# EAGLE design M7101 (EAGLE 6.6.0)
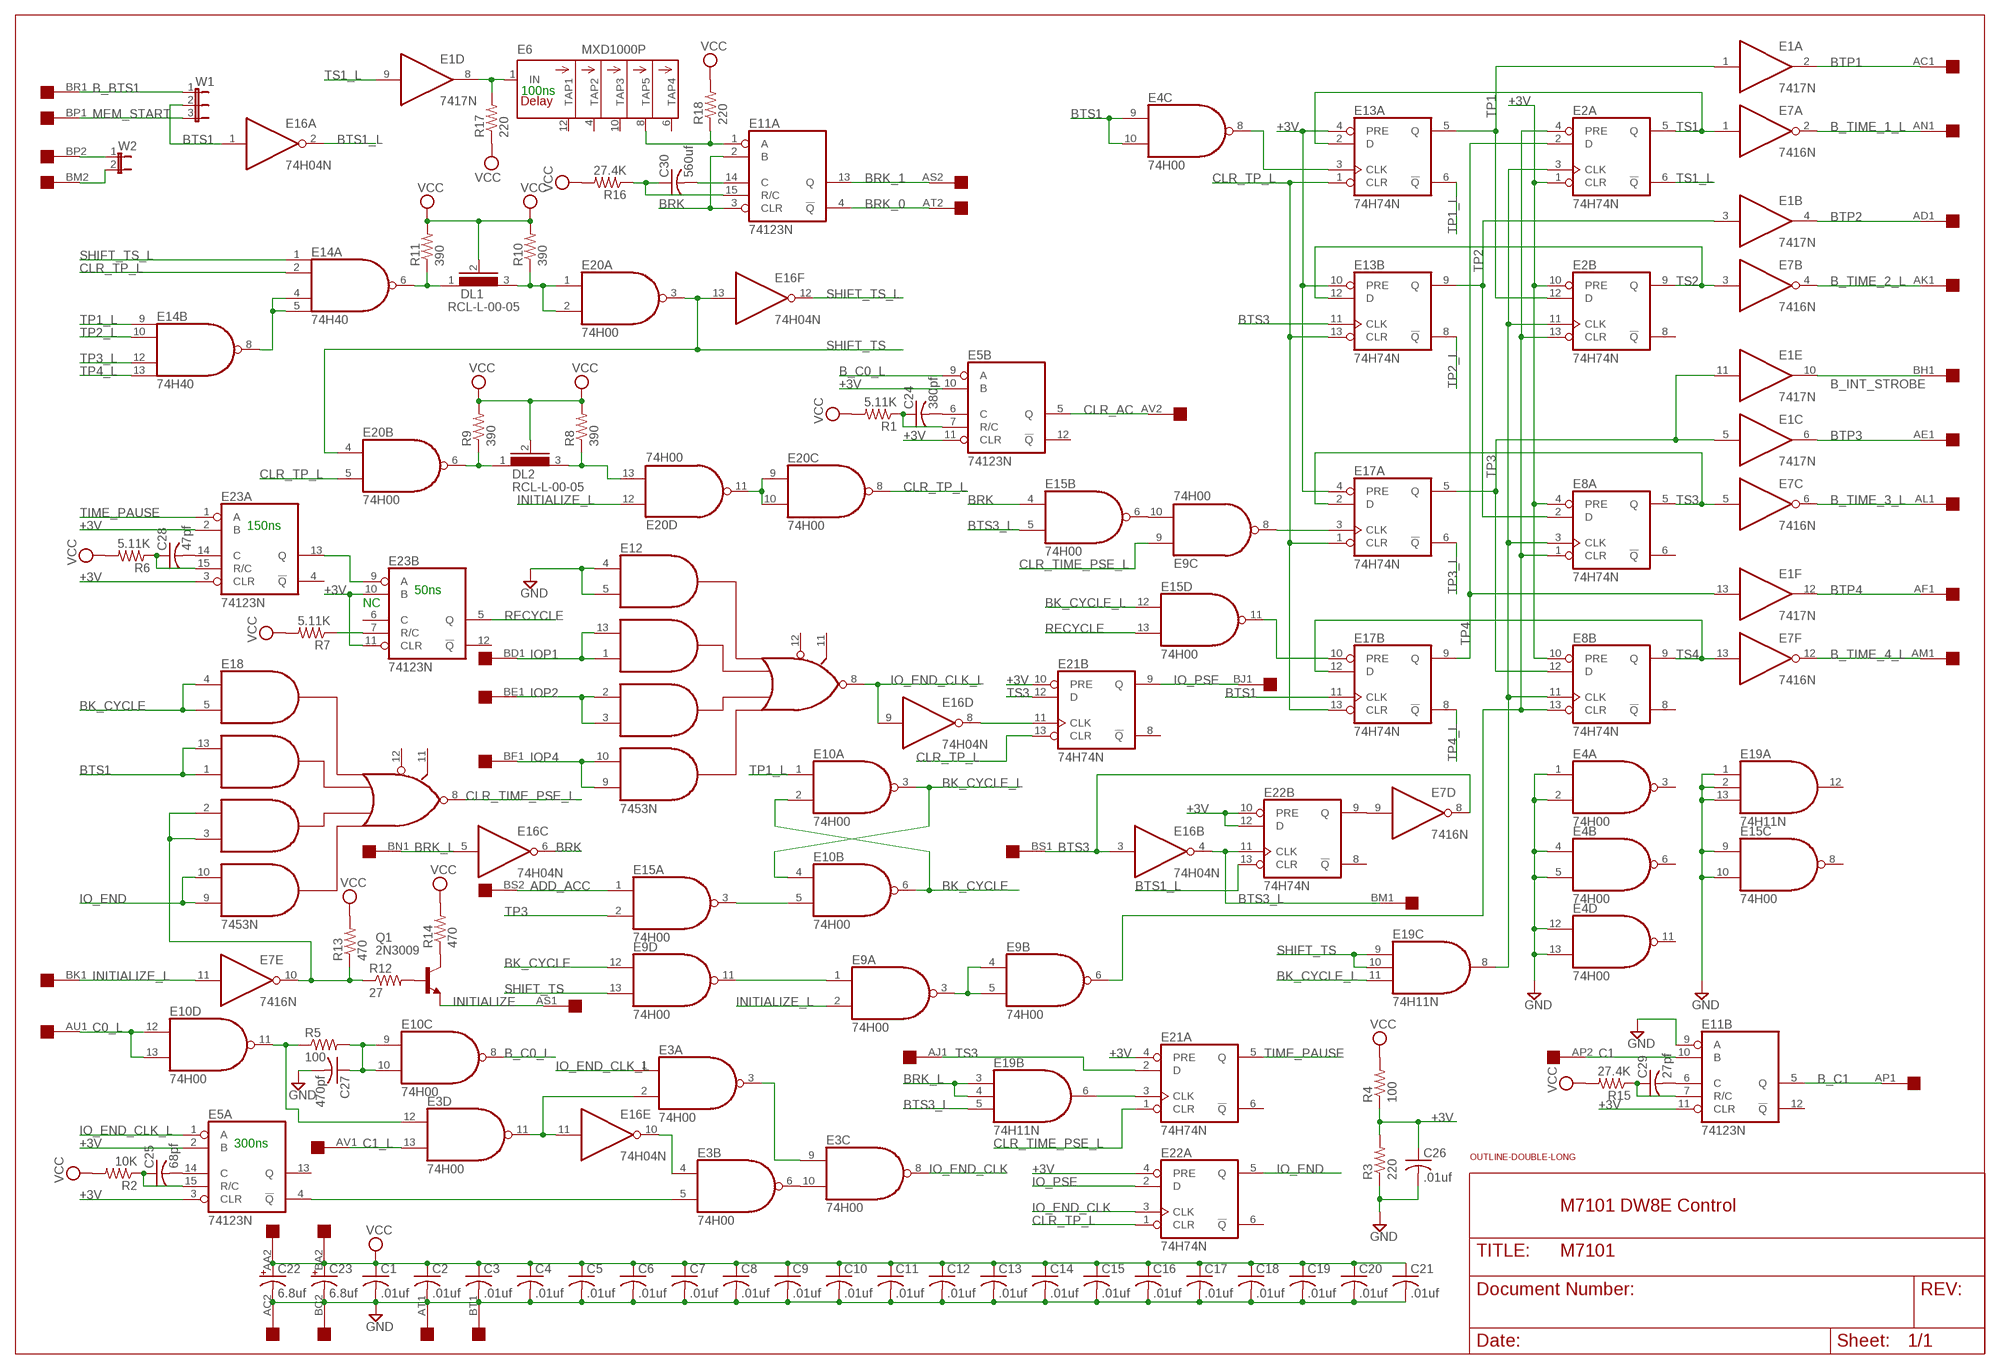
[diagram p0: schematic, sheet 1]

## Parts
C1  .01uf  C-US050-025X075  [C050-025X075]
C2  .01uf  C-US050-025X075  [C050-025X075]
C3  .01uf  C-US050-025X075  [C050-025X075]
C4  .01uf  C-US050-025X075  [C050-025X075]
C5  .01uf  C-US050-025X075  [C050-025X075]
C6  .01uf  C-US050-025X075  [C050-025X075]
C7  .01uf  C-US050-025X075  [C050-025X075]
C8  .01uf  C-US050-025X075  [C050-025X075]
C9  .01uf  C-US050-025X075  [C050-025X075]
C10  .01uf  C-US050-025X075  [C050-025X075]
C11  .01uf  C-US050-025X075  [C050-025X075]
C12  .01uf  C-US050-025X075  [C050-025X075]
C13  .01uf  C-US050-025X075  [C050-025X075]
C14  .01uf  C-US050-025X075  [C050-025X075]
C15  .01uf  C-US050-025X075  [C050-025X075]
C16  .01uf  C-US050-025X075  [C050-025X075]
C17  .01uf  C-US050-025X075  [C050-025X075]
C18  .01uf  C-US050-025X075  [C050-025X075]
C19  .01uf  C-US050-025X075  [C050-025X075]
C20  .01uf  C-US050-025X075  [C050-025X075]
C21  .01uf  C-US050-025X075  [C050-025X075]
C22  6.8uf  CPOL-USE22-6AXIAL  [E22-6]
C23  6.8uf  CPOL-USE22-6AXIAL  [E22-6]
C24  380pf  C-US050-025X075  [C050-025X075]
C25  68pf  C-US050-025X075  [C050-025X075]
C26  .01uf  C-US050-025X075  [C050-025X075]
C27  470pf  C-US050-025X075  [C050-025X075]
C28  47pf  C-US050-025X075  [C050-025X075]
C29  27pf  C-US050-025X075  [C050-025X075]
C30  560uf  C-US050-025X075  [C050-025X075]
DL1  RCL-L-00-05  [RCL-L-00-05]
DL2  RCL-L-00-05  [RCL-L-00-05]
E1  7417N  [DIL14]
E2  74H74N  74S74N  [DIL14]
E3  74H00  7400N  [DIL14]
E4  74H00  7400N  [DIL14]
E5  74123N  [DIL16]
E6  MXD1000P  [DIL14]
E7  7416N  [DIL14]
E8  74H74N  74S74N  [DIL14]
E9  74H00  7400N  [DIL14]
E10  74H00  7400N  [DIL14]
E11  74123N  [DIL16]
E12  7453N  [DIL14]
E13  74H74N  74S74N  [DIL14]
E14  74H40  74S20N  [DIL14]
E15  74H00  7400N  [DIL14]
E16  74H04N  7404N  [DIL14]
E17  74H74N  74S74N  [DIL14]
E18  7453N  [DIL14]
E19  74H11N  74S11N  [DIL14]
E20  74H00  7400N  [DIL14]
E21  74H74N  74S74N  [DIL14]
E22  74H74N  74S74N  [DIL14]
E23  74123N  [DIL16]
EDGE  DOUBLE  [EDGE-CON4]
Q1  2N3009  2N2222  [TO18]
R1  5.11K  R-US_0207/10  [0207/10]
R2  10K  R-US_0207/10  [0207/10]
R3  220  R-US_0207/10  [0207/10]
R4  100  R-US_0207/10  [0207/10]
R5  100  R-US_0207/10  [0207/10]
R6  5.11K  R-US_0207/10  [0207/10]
R7  5.11K  R-US_0207/10  [0207/10]
R8  390  R-US_0207/10  [0207/10]
R9  390  R-US_0207/10  [0207/10]
R10  390  R-US_0207/10  [0207/10]
R11  390  R-US_0207/10  [0207/10]
R12  27  R-US_0207/10  [0207/10]
R13  470  R-US_0207/10  [0207/10]
R14  470  R-US_0207/10  [0207/10]
R15  27.4K  R-US_0207/10  [0207/10]
R16  27.4K  R-US_0207/10  [0207/10]
R17  220  R-US_0207/10  [0207/10]
R18  220  R-US_0207/10  [0207/10]
U$1  OUTLINE-DOUBLE-LONG  [DOUBLE-LONG]
W1  JP2E  [JP2]
W2  JP1E  [JP1]

## Nets
+3V: C26.1 E2.1(A:CLR) E2.10(B:PRE) E5.2(A:B) E5.3(A:CLR) E5.10(B:B) E5.11(B:CLR) E8.4(A:PRE) E8.10(B:PRE) E11.11(B:CLR) E13.4(A:PRE) E13.10(B:PRE) E17.4(A:PRE) E21.4(A:PRE) E21.10(B:PRE) E22.4(A:PRE) E22.10(B:PRE) E22.12(B:D) E23.2(A:B) E23.3(A:CLR) E23.10(B:B) E23.11(B:CLR) R3.2 R4.1
ADD_ACC: E15.1(A:I0) EDGE.BS2
B_BTS1: EDGE.BR1 W1.1
B_C0_L: E5.9(B:A) E10.8(C:O)
B_C1: E11.5(B:Q) EDGE.AP1
B_INT_STROBE: E1.10(E:O) EDGE.BH1
B_TIME_1_L: E7.2(A:O) EDGE.AN1
B_TIME_2_L: E7.4(B:O) EDGE.AK1
B_TIME_3_L: E7.6(C:O) EDGE.AL1
B_TIME_4_L: E7.12(F:O) EDGE.AM1
BK_CYCLE: E9.12(D:I0) E10.2(A:I1) E10.6(B:O) E18.4(I1) E18.5(I2)
BK_CYCLE_L: E10.3(A:O) E10.4(B:I0) E15.12(D:I0) E19.11(C:I2)
BRK: E11.2(A:B) E11.3(A:CLR) E15.4(B:I0) E16.6(C:O)
BRK_0: E11.4(A:!Q) EDGE.AT2
BRK_1: E11.13(A:Q) EDGE.AS2
BRK_L: E16.5(C:I) E19.3(B:I0) E19.4(B:I1) EDGE.BN1
BTP1: E1.2(A:O) EDGE.AC1
BTP2: E1.4(B:O) EDGE.AD1
BTP3: E1.6(C:O) EDGE.AE1
BTP4: E1.12(F:O) EDGE.AF1
BTS1: E4.9(C:I0) E4.10(C:I1) E16.1(A:I) E17.11(B:CLK) E18.1(I4) E18.13(I3) W1.2
BTS1_L: E16.2(A:O) E22.13(B:CLR)
BTS3: E7.8(D:O) E13.11(B:CLK) E16.3(B:I) EDGE.BS1
BTS3_L: E15.5(B:I1) E16.4(B:O) E19.5(B:I2) E22.11(B:CLK) EDGE.BM1
C0_L: E10.12(D:I0) E10.13(D:I1) EDGE.AU1
C1: E11.10(B:B) EDGE.AP2
C1_L: E3.13(D:I1) EDGE.AV1
CLR_AC: E5.5(B:Q) EDGE.AV2
CLR_TIME_PSE_L: E9.9(C:I0) E18.8(O) E21.1(A:CLR)
CLR_TP_L: E13.1(A:CLR) E13.13(B:CLR) E14.2(A:I1) E17.1(A:CLR) E17.13(B:CLR) E20.5(B:I1) E20.8(C:O) E21.13(B:CLR) E22.1(A:CLR)
GND [Power]: C1.2 C2.2 C3.2 C4.2 C5.2 C6.2 C7.2 C8.2 C9.2 C10.2 C11.2 C12.2 C13.2 C14.2 C15.2 C16.2 C17.2 C18.2 C19.2 C20.2 C21.2 C22.- C23.- C26.2 C27.2 E4.1(A:I0) E4.2(A:I1) E4.4(B:I0) E4.5(B:I1) E4.12(D:I0) E4.13(D:I1) E11.9(B:A) E12.4(I1) E12.5(I2) E15.9(C:I0) E15.10(C:I1) E19.1(A:I0) E19.2(A:I1) E19.13(A:I2) EDGE.AC2 EDGE.AT1 EDGE.BC2 EDGE.BT1 R3.1
INIT: E7.10(E:O) E18.2(I5) E18.3(I6) R12.1 R13.1
INITIALIZE: EDGE.AS1 Q1.1(E)
INITIALIZE_L: E7.11(E:I) E9.2(A:I1) E20.12(D:I0) EDGE.BK1
IO_END: E18.9(I8) E18.10(I7) E22.5(A:Q)
IO_END_CLK: E3.8(C:O) E22.3(A:CLK)
IO_END_CLK_L: E3.1(A:I0) E5.1(A:A) E12.8(O) E16.9(D:I)
IO_PSE: E21.9(B:Q) E22.2(A:D) EDGE.BJ1
IOP1: E12.1(I4) E12.13(I3) EDGE.BD1
IOP2: E12.2(I5) E12.3(I6) EDGE.BE1
IOP4: E12.9(I8) E12.10(I7) EDGE.BF1
MEM_START: EDGE.BP1 W1.3
N$1: E6.8(TAP5) E11.1(A:A) R18.1
N$2: E1.8(D:O) E6.1(IN) R17.2
N$4: C30.1 E11.15(A:R/C) R16.1
N$5: C30.2 E11.14(A:C)
N$6: E9.8(C:O) E17.3(A:CLK)
N$7: E14.4(A:I2) E14.5(A:I3) E14.8(B:O)
N$8: DL1.1 E14.6(A:O) R11.1
N$9: DL1.3 E20.1(A:I0) E20.2(A:I1) R10.1
N$10: DL2.1 E20.6(B:O) R9.1
N$11: DL2.3 E20.13(D:I1) R8.1
N$12: E20.9(C:I0) E20.10(C:I1) E20.11(D:O)
N$13: C28.2 E23.14(A:C)
N$14: C28.1 E23.15(A:R/C) R6.1
N$15: E23.9(B:A) E23.13(A:Q)
N$16: E23.7(B:R/C) R7.1
N$17: Q1.2(B) R12.2
N$18: Q1.3(C) R14.1
N$20: E3.12(D:I0) E10.11(D:O) R5.1
N$21: C27.1 E10.9(C:I0) E10.10(C:I1) R5.2
N$22: C25.2 E5.14(A:C)
N$23: C25.1 E5.15(A:R/C) R2.1
N$24: E3.5(B:I1) E5.4(A:!Q)
N$25: E3.4(B:I0) E16.10(E:O)
N$26: E3.2(A:I1) E3.11(D:O) E16.11(E:I)
N$27: E3.6(B:O) E3.10(C:I1)
N$28: E3.3(A:O) E3.9(C:I0)
N$29: E16.8(D:O) E21.11(B:CLK)
N$30: E10.5(B:I1) E15.3(A:O)
N$31: E9.1(A:I0) E9.11(D:O)
N$32: E9.3(A:O) E9.4(B:I0) E9.5(B:I1)
N$33: C29.2 E11.6(B:C)
N$34: C29.1 E11.7(B:R/C) R15.1
N$35: E9.10(C:I1) E15.6(B:O)
N$36: E4.8(C:O) E13.3(A:CLK)
N$37: E2.4(A:PRE) E2.13(B:CLR) E8.1(A:CLR) E8.13(B:CLR) E9.6(B:O)
N$38: E19.6(B:O) E21.3(A:CLK)
N$39: C24.2 E5.6(B:C)
N$40: C24.1 E5.7(B:R/C) R1.1
N$41: E7.9(D:I) E22.9(B:Q)
N$42: E15.11(D:O) E17.10(B:PRE)
N$43: EDGE.BP2 W2.1
N$44: E2.3(A:CLK) E2.11(B:CLK) E8.3(A:CLK) E8.11(B:CLK) E19.8(C:O)
N$45: EDGE.BM2 W2.2
RECYCLE: E15.13(D:I1) E23.5(B:Q)
SHIFT_TS: E9.13(D:I1) E16.13(F:I) E19.9(C:I0) E19.10(C:I1) E20.3(A:O) E20.4(B:I0)
SHIFT_TS_L: E14.1(A:I0) E16.12(F:O)
TIME_PAUSE: E21.5(A:Q) E23.1(A:A)
TP1: E1.1(A:I) E2.12(B:D) E13.5(A:Q)
TP1_L: E10.1(A:I0) E13.6(A:!Q) E14.9(B:I0)
TP2: E1.3(B:I) E8.2(A:D) E13.9(B:Q)
TP2_L: E13.8(B:!Q) E14.10(B:I1)
TP3: E1.5(C:I) E1.11(E:I) E8.12(B:D) E15.2(A:I1) E17.5(A:Q)
TP3_L: E14.12(B:I2) E17.6(A:!Q)
TP4: E1.13(F:I) E2.2(A:D) E17.9(B:Q)
TP4_L: E14.13(B:I3) E17.8(B:!Q)
TS1: E2.5(A:Q) E7.1(A:I) E13.2(A:D)
TS1_L: E1.9(D:I) E2.6(A:!Q)
TS2: E2.9(B:Q) E7.3(B:I) E13.12(B:D)
TS3: E7.5(C:I) E8.5(A:Q) E17.2(A:D) E21.2(A:D) E21.12(B:D) EDGE.AJ1
TS4: E7.13(F:I) E8.9(B:Q) E17.12(B:D)
VCC [Power]: C1.1 C2.1 C3.1 C4.1 C5.1 C6.1 C7.1 C8.1 C9.1 C10.1 C11.1 C12.1 C13.1 C14.1 C15.1 C16.1 C17.1 C18.1 C19.1 C20.1 C21.1 C22.+ C23.+ DL1.2 DL2.2 EDGE.AA2 EDGE.BA2 R1.2 R2.2 R4.2 R6.2 R7.2 R8.2 R9.2 R10.2 R11.2 R13.2 R14.2 R15.2 R16.2 R17.1 R18.2
Unconnected: E2.8(B:!Q) E4.3(A:O) E4.6(B:O) E4.11(D:O) E5.12(B:!Q) E5.13(A:Q) E6.2(NC) E6.3(NC) E6.4(TAP2) E6.5(NC) E6.6(TAP4) E6.9(NC) E6.10(TAP3) E6.11(NC) E6.12(TAP1) E6.13(NC) E8.6(A:!Q) E8.8(B:!Q) E11.12(B:!Q) E12.6(SPARE) E12.11(I10) E12.12(I9) E15.8(C:O) E18.6(SPARE) E18.11(I10) E18.12(I9) E19.12(A:O) E21.6(A:!Q) E21.8(B:!Q) E22.6(A:!Q) E22.8(B:!Q) E23.4(A:!Q) E23.6(B:C) E23.12(B:!Q) EDGE.AA1 EDGE.AB1 EDGE.AB2 EDGE.AD2 EDGE.AE2 EDGE.AF2 EDGE.AH1 EDGE.AH2 EDGE.AJ2 EDGE.AK2 EDGE.AL2 EDGE.AM2 EDGE.AN2 EDGE.AR1 EDGE.AR2 EDGE.AU2 EDGE.BA1 EDGE.BB1 EDGE.BB2 EDGE.BC1 EDGE.BD2 EDGE.BE2 EDGE.BF2 EDGE.BH2 EDGE.BJ2 EDGE.BK2 EDGE.BL1 EDGE.BL2 EDGE.BN2 EDGE.BR2 EDGE.BT2 EDGE.BU1 EDGE.BU2 EDGE.BV1 EDGE.BV2

## Notes on the sheet
- 100ns
- 150ns
- 50ns
- NC
- 300ns
- M7101 DW8E Control

## Power pins joined to a net without a drawn wire
GND: E1.7(P:GND) E2.7(P:GND) E3.7(P:GND) E4.7(P:GND) E5.8(P:GND) E6.7(GND) E7.7(P:GND) E8.7(P:GND) E9.7(P:GND) E10.7(P:GND) E11.8(P:GND) E12.7(GND) E13.7(P:GND) E14.7(P:GND) E15.7(P:GND) E16.7(P:GND) E17.7(P:GND) E18.7(GND) E19.7(P:GND) E20.7(P:GND) E21.7(P:GND) E22.7(P:GND) E23.8(P:GND)
VCC: E1.14(P:VCC) E2.14(P:VCC) E3.14(P:VCC) E4.14(P:VCC) E5.16(P:VCC) E6.14(VCC) E7.14(P:VCC) E8.14(P:VCC) E9.14(P:VCC) E10.14(P:VCC) E11.16(P:VCC) E12.14(VCC) E13.14(P:VCC) E14.14(P:VCC) E15.14(P:VCC) E16.14(P:VCC) E17.14(P:VCC) E18.14(VCC) E19.14(P:VCC) E20.14(P:VCC) E21.14(P:VCC) E22.14(P:VCC) E23.16(P:VCC)

## Library data of the parts
C1-C21 C24-C30 = rcl:C-US: CAPACITOR, American symbol
C22 C23 = rcl:CPOL-US: POLARIZED CAPACITOR, American symbol
DL1 DL2 = dec-con:RCL-L-00-05: RCL-L Delay Line
E1 = 74xx-eu:74*17: Hex open collector, high-voltage
E2 E8 E13 E17 E21 E22 = 74xx-us:74*74: Dual D type positive edge triggered FLIP FLOP, preset and clear
E3 E4 E9 E10 E15 E20 = 74xx-us:74*00: Quad 2-input NAND gate
E5 E11 E23 = 74xx-us:74*123: Retriggerable monostable MULTIVIBRATOR
E6 = maxim:MXD1000P: DELAY LINE; OC_FARNELL: unknown; OC_NEWARK: unknown
E7 = 74xx-us:74*16: Hex INVERTER, open collector, high-voltage
E12 E18 = dec-con:74*53: 4-2-3-2 input AND OR INVERTER gates
E14 = 74xx-us:74*20: Dual 4-input NAND gate
E16 = 74xx-us:74*04: Hex INVERTER
E19 = 74xx-us:74*11: Triple 3-input AND gate
EDGE = dec-con:DOUBLE: Double-Height DEC board
Q1 = transistor:2N2222: NPN TRANSISTOR
R1-R18 = rcl:R-US_: RESISTOR, American symbol
U$1 = dec-con:OUTLINE-*: Board outlines for DEC boards.
W1 = jumper:JP2E: JUMPER
W2 = jumper:JP1E: JUMPER

## Net classes
0 default: width 0.508 mm
1 Power: width 1.27 mm

## Board
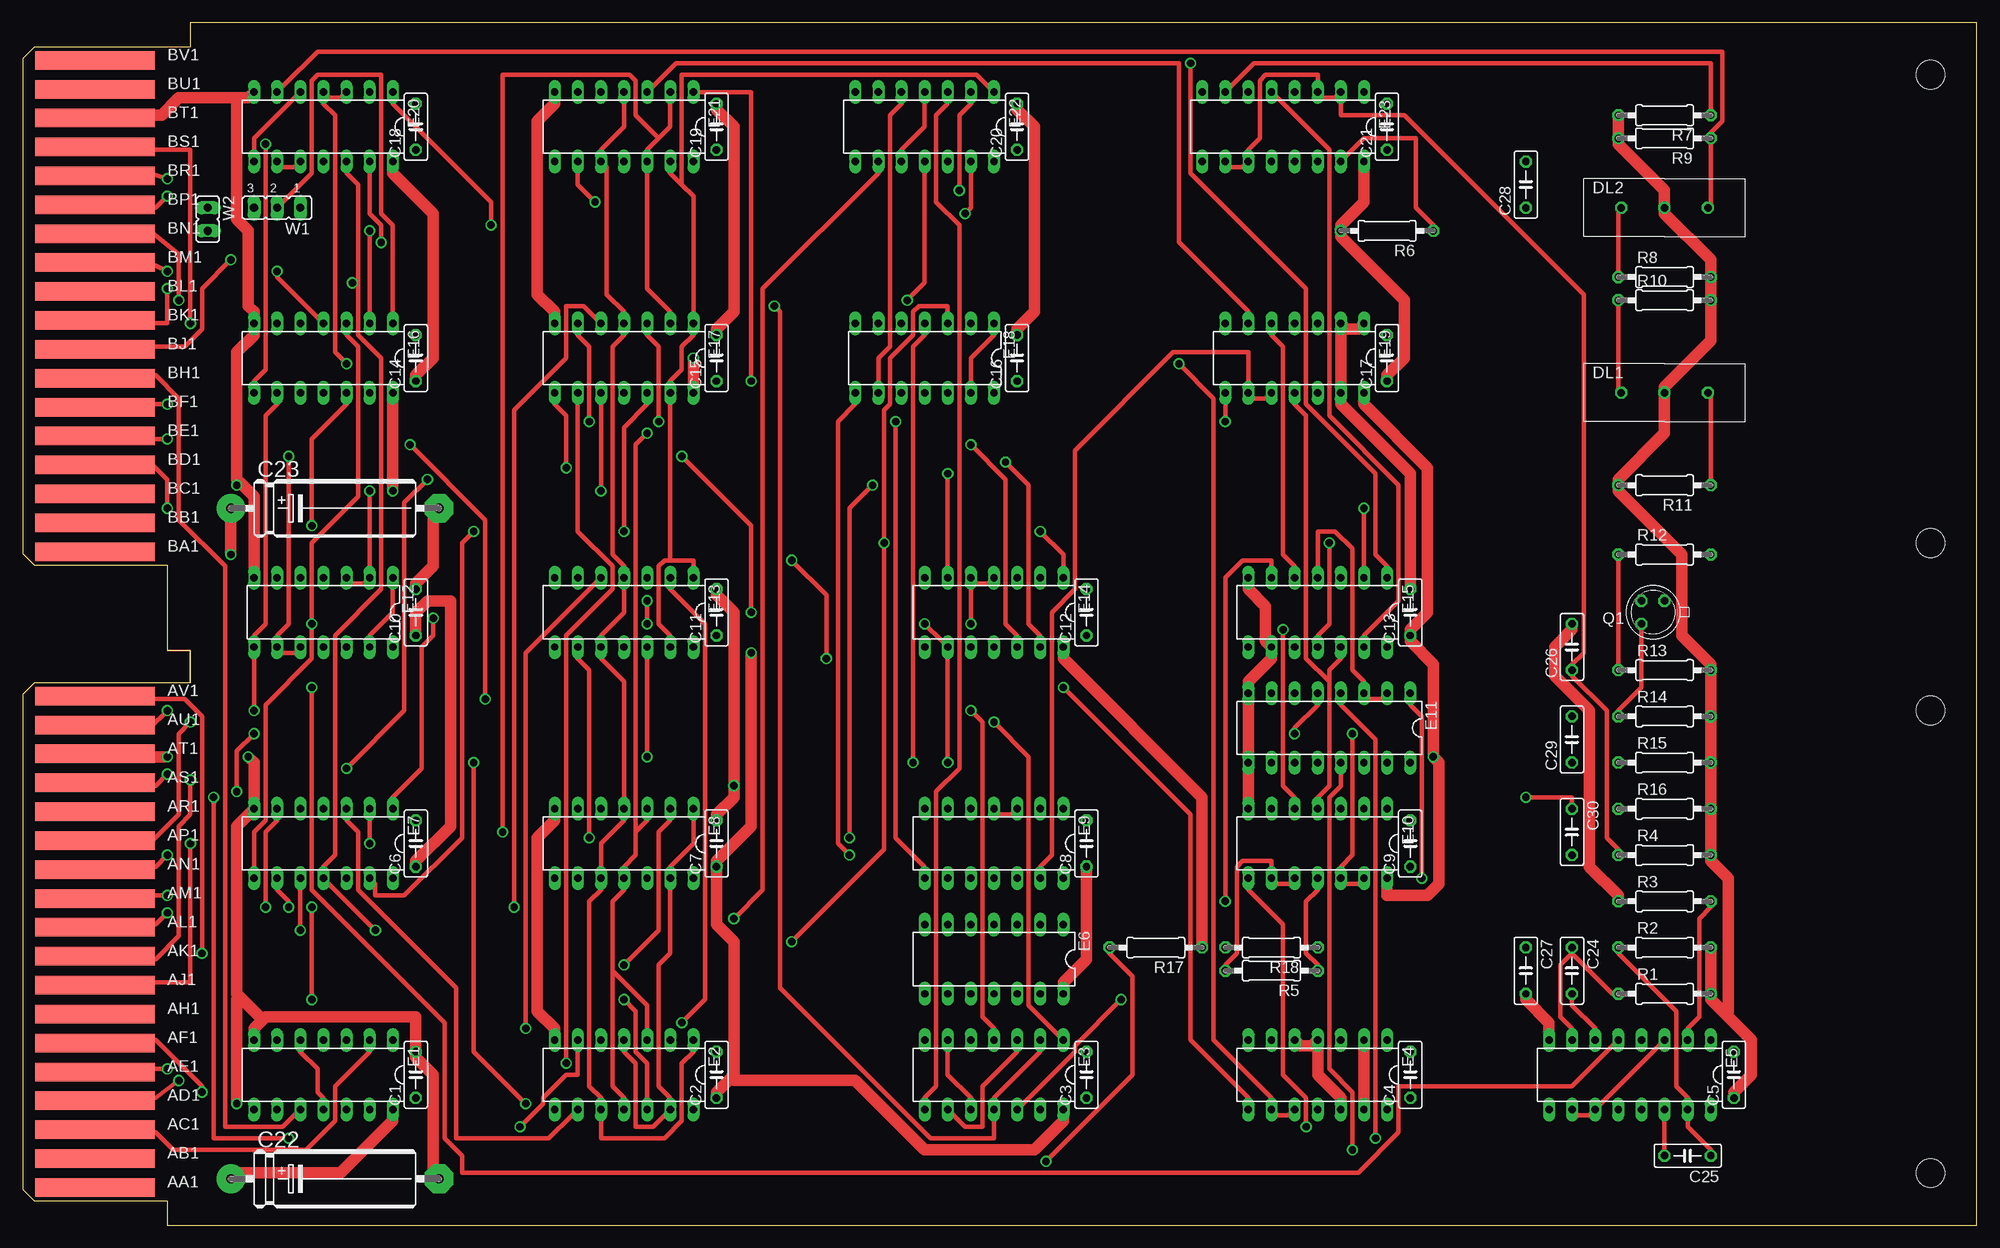
[diagram p1: board, top side]
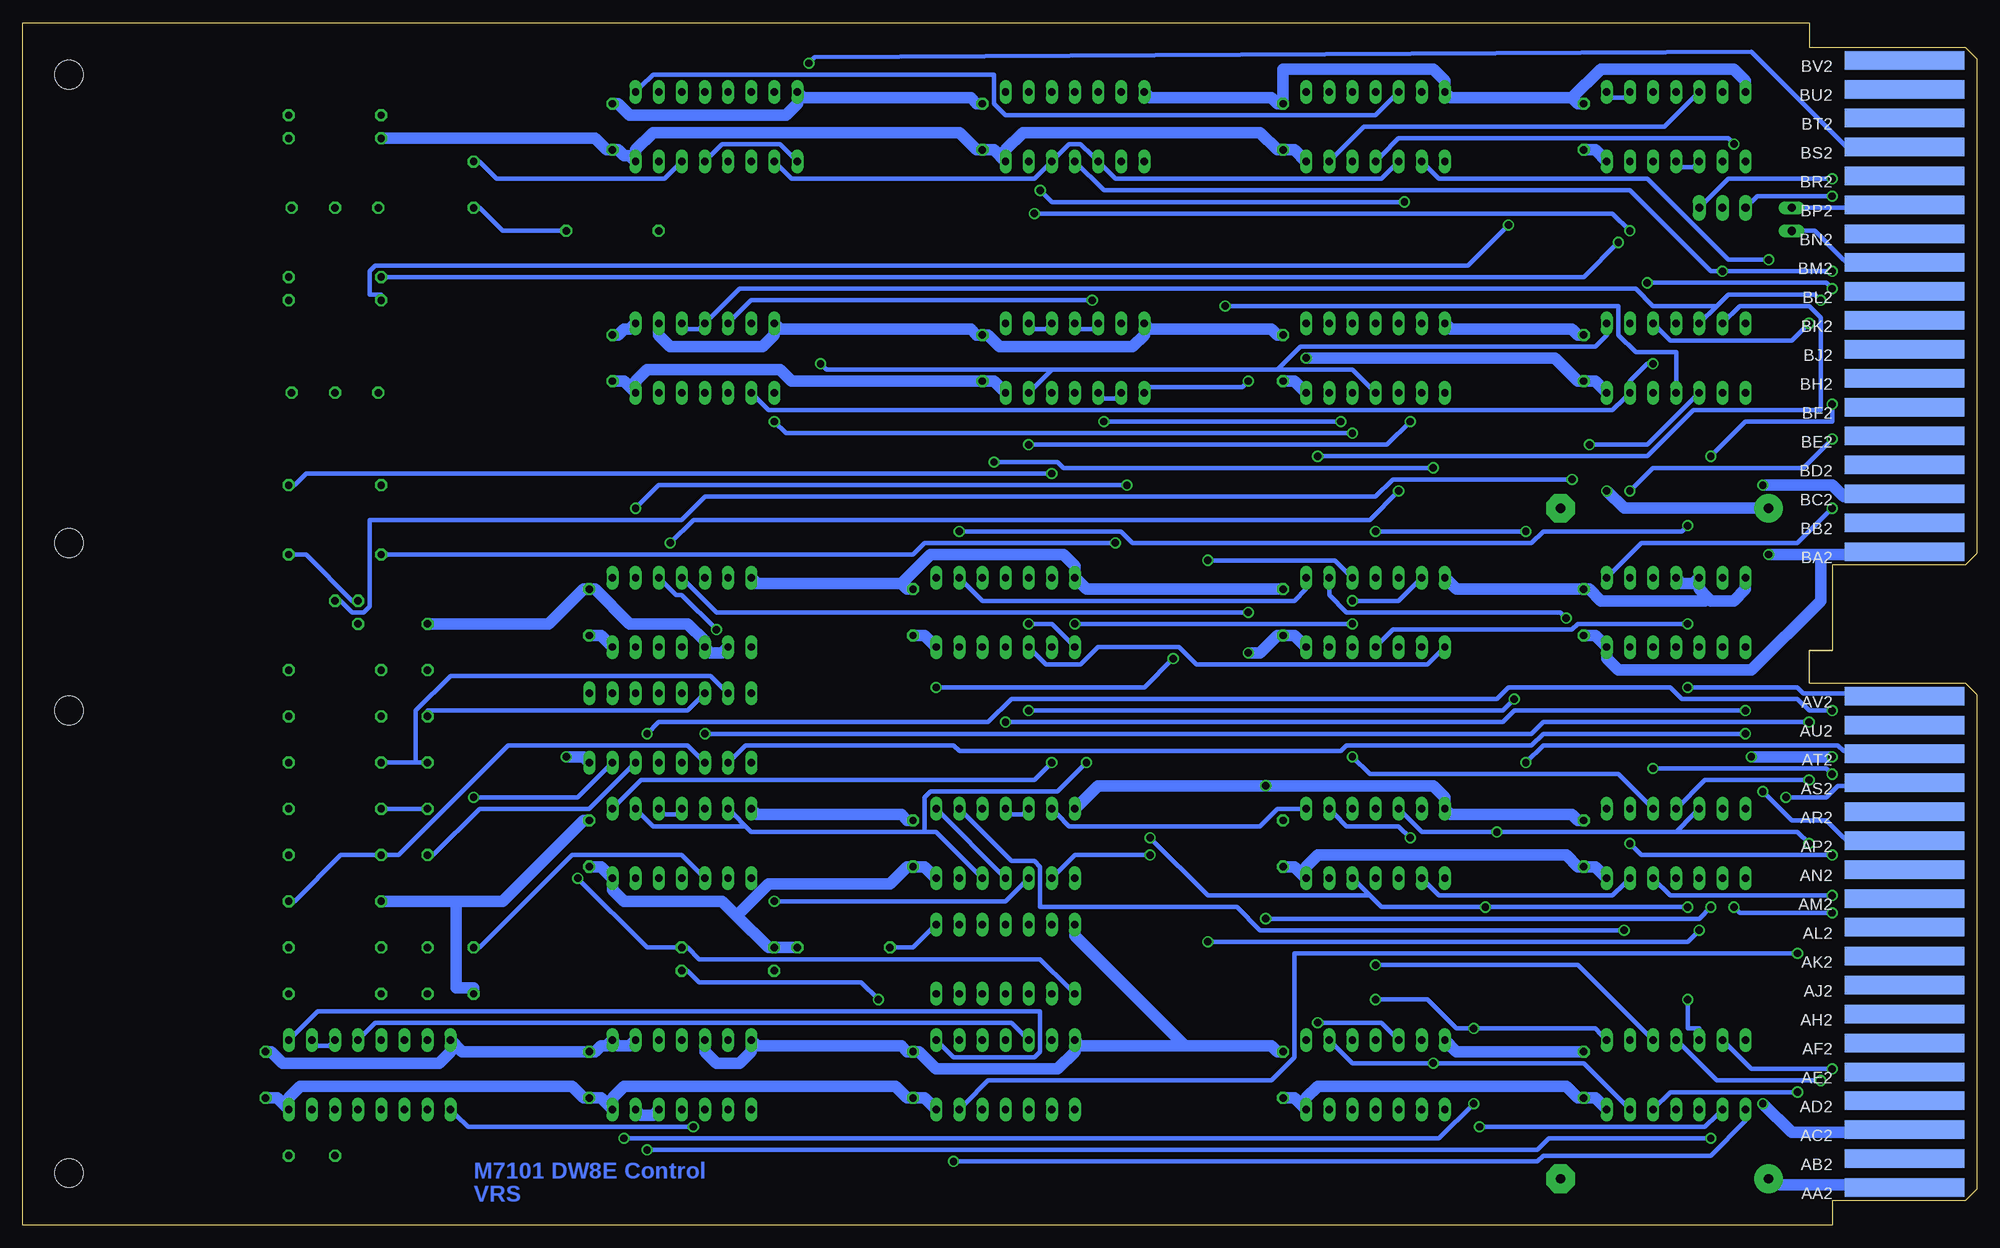
[diagram p2: board, bottom side, seen from below]

Size 214.63 x 132.08 mm. Coordinates in mm from the lower left corner, seen from the top.
Copper layers (1+16): Top 0.035mm / dielectric 1.5mm / Bottom 0.035mm
Design rules "16mils": minimum track width 16mil, minimum drill 32mil, track to track 15mil, track to pad 10mil, pad to pad 10mil, via to via 10mil, smd to smd 10mil, copper to edge 13mil, drill to drill 10mil, minimum pad ring 10mil, minimum via ring 8mil, stop-mask expansion 0mil, vias tented up to drill 0mil, thermal gap 10mil

### Footprints (pad centres in the part's own frame; a part is rotated, then mirrored left to right if it is on the bottom)
C050-025X075 = drill 0.813 octagon: 1 -2.54,0; 2 2.54,0
E22-6 = drill 1.016 pad 3.15: + -11.43,0 | drill 1.016 pad 3.15 octagon: - 11.43,0
RCL-L-00-05 = drill 0.813 octagon: 1 4.763,0; 2 0,0; 3 -4.763,0
DIL14 = drill 0.813 long: 1 -7.62,-3.81; 2 -5.08,-3.81; 3 -2.54,-3.81; 4 0,-3.81; 5 2.54,-3.81; 6 5.08,-3.81; 7 7.62,-3.81; 8 7.62,3.81; 9 5.08,3.81; 10 2.54,3.81; 11 0,3.81; 12 -2.54,3.81; 13 -5.08,3.81; 14 -7.62,3.81
DIL16 = drill 0.813 long: 1 -8.89,-3.81; 2 -6.35,-3.81; 3 -3.81,-3.81; 4 -1.27,-3.81; 5 1.27,-3.81; 6 3.81,-3.81; 7 6.35,-3.81; 8 8.89,-3.81; 9 8.89,3.81; 10 6.35,3.81; 11 3.81,3.81; 12 1.27,3.81; 13 -1.27,3.81; 14 -3.81,3.81; 15 -6.35,3.81; 16 -8.89,3.81
EDGE-CON4 = smd 13.106 x 2.032: AA1 7.938,4.128; AB1 7.938,7.303; AC1 7.938,10.477; AD1 7.938,13.652; AE1 7.938,16.828; AF1 7.938,20.003; AH1 7.938,23.177; AJ1 7.938,26.352; AK1 7.938,29.527; AL1 7.938,32.703; AM1 7.938,35.877; AN1 7.938,39.053; AP1 7.938,42.227; AR1 7.938,45.403; AS1 7.938,48.578; AT1 7.938,51.752; AU1 7.938,54.928; AV1 7.938,58.102; BA1 7.938,73.978; BB1 7.938,77.153; BC1 7.938,80.328; BD1 7.938,83.502; BE1 7.938,86.677; BF1 7.938,89.853; BH1 7.938,93.028; BJ1 7.938,96.203; BK1 7.938,99.377; BL1 7.938,102.552; BM1 7.938,105.728; BN1 7.938,108.903; BP1 7.938,112.078; BR1 7.938,115.252; BS1 7.938,118.427; BT1 7.938,121.603; BU1 7.938,124.778; BV1 7.938,127.953 | smd 13.106 x 2.032 bottom: AA2 7.938,4.128; AB2 7.938,7.303; AC2 7.938,10.477; AD2 7.938,13.652; AE2 7.938,16.828; AF2 7.938,20.003; AH2 7.938,23.177; AJ2 7.938,26.352; AK2 7.938,29.527; AL2 7.938,32.703; AM2 7.938,35.877; AN2 7.938,39.053; AP2 7.938,42.227; AR2 7.938,45.403; AS2 7.938,48.578; AT2 7.938,51.752; AU2 7.938,54.928; AV2 7.938,58.102; BA2 7.938,73.978; BB2 7.938,77.153; BC2 7.938,80.328; BD2 7.938,83.502; BE2 7.938,86.677; BF2 7.938,89.853; BH2 7.938,93.028; BJ2 7.938,96.203; BK2 7.938,99.377; BL2 7.938,102.552; BM2 7.938,105.728; BN2 7.938,108.903; BP2 7.938,112.078; BR2 7.938,115.252; BS2 7.938,118.427; BT2 7.938,121.603; BU2 7.938,124.778; BV2 7.938,127.953
TO18 = drill 0.813 octagon: 1 -1.27,-1.27; 2 1.27,-1.27; 3 1.27,1.27
0207/10 = drill 0.813 octagon: 1 -5.08,0; 2 5.08,0
DOUBLE-LONG = hole 3.175: 209.55,56.515; 209.55,5.715; 209.55,74.93; 209.55,126.365
JP2 = drill 0.914 long: 1 -2.54,0; 2 0,0; 3 2.54,0
JP1 = drill 0.914 long: 1 0,-1.27; 2 0,1.27

### Placement (x,y rotation side)
C1  43.18,16.51 90 top
C2  76.2,16.51 90 top
C3  116.84,16.51 90 top
C4  152.4,16.51 90 top
C5  187.96,16.51 90 top
C6  43.18,41.91 90 top
C7  76.2,41.91 90 top
C8  116.84,41.91 90 top
C9  152.4,41.91 90 top
C10  43.18,67.31 90 top
C11  76.2,67.31 90 top
C12  116.84,67.31 90 top
C13  152.4,67.31 90 top
C14  43.18,95.25 90 top
C15  76.2,95.25 90 top
C16  109.22,95.25 90 top
C17  149.86,95.25 90 top
C18  43.18,120.65 90 top
C19  76.2,120.65 90 top
C20  109.22,120.65 90 top
C21  149.86,120.65 90 top
C22  34.29,5.08 0 top
C23  34.29,78.74 0 top
C24  170.18,27.94 270 top
C25  182.88,7.62 180 top
C26  170.18,63.5 90 top
C27  165.1,27.94 270 top
C28  165.1,114.3 90 top
C29  170.18,53.34 90 top
C30  170.18,43.18 270 top
DL1  180.34,91.44 0 top
DL2  180.34,111.76 0 top
E1  33.02,16.51 180 top
E2  66.04,16.51 180 top
E3  106.68,16.51 180 top
E4  142.24,16.51 180 top
E5  176.53,16.51 180 top
E6  106.68,29.21 180 top
E7  33.02,41.91 180 top
E8  66.04,41.91 180 top
E9  106.68,41.91 180 top
E10  142.24,41.91 180 top
E11  143.51,54.61 180 top
E12  33.02,67.31 180 top
E13  66.04,67.31 180 top
E14  106.68,67.31 180 top
E15  142.24,67.31 180 top
E16  33.02,95.25 180 top
E17  66.04,95.25 180 top
E18  99.06,95.25 180 top
E19  139.7,95.25 180 top
E20  33.02,120.65 180 top
E21  66.04,120.65 180 top
E22  99.06,120.65 180 top
E23  138.43,120.65 180 top
EDGE  0,0 0 top
Q1  179.07,67.31 180 top
R1  180.34,25.4 0 top
R2  180.34,30.48 0 top
R3  180.34,35.56 0 top
R4  180.34,40.64 0 top
R5  137.16,27.94 180 top
R6  149.86,109.22 180 top
R7  180.34,121.92 180 top
R8  180.34,104.14 0 top
R9  180.34,119.38 180 top
R10  180.34,101.6 0 top
R11  180.34,81.28 180 top
R12  180.34,73.66 0 top
R13  180.34,60.96 0 top
R14  180.34,55.88 0 top
R15  180.34,50.8 0 top
R16  180.34,45.72 0 top
R17  124.46,30.48 180 top
R18  137.16,30.48 180 top
U$1  0,0 0 top
W1  27.94,111.76 180 top
W2  20.32,110.49 180 top

### Tracks (layer width: path | path; a pad name or v marks a point on that pad's centre or on a via)
+3V
  Top 0.508: E5.10 170.82,12.06 172.09,12.06 E5.11 173.36,13.34 179.71,19.68 E5.3 | R4.1 175.26,41.27 173.99,42.55 173.99,56.52 170.18,60.33 C26.1 170.18,61.59 171.45,62.87 171.45,102.23 151.77,121.92 144.78,121.92 144.78,123.19 E23.2 144.15,123.83 142.88,123.83 E23.3 142.24,125.73 142.24,126.36 136.53,126.36 135.89,125.73 135.89,119.38 134.62,118.11 E23.11 133.99,116.2 132.72,116.2 E23.10 | E5.2 182.88,21.59 184.15,22.86 184.15,33.66 185.42,34.92 R3.2 | E22.10 96.52,118.11 99.06,120.65 99.06,123.19 E22.4 | E21.4 66.04,123.19 66.04,120.65 63.5,118.11 E21.10 64.14,116.2 64.14,102.23 66.04,100.33 E17.4 66.04,97.79 64.77,96.52 64.77,73.66 66.04,72.39 E13.4 66.04,69.85 66.04,67.31 63.5,64.77 E13.10 63.5,62.23 66.04,59.69 66.04,46.99 E8.4 66.04,44.45 63.5,41.91 63.5,39.37 E8.10 63.5,36.83 62.23,35.56 62.23,15.24 63.5,13.97 E2.10 63.5,11.43 63.5,9.53 70.49,9.53 72.39,11.43 72.39,17.78 73.66,19.05 E2.1
  Bottom 0.508: E5.3 180.98,19.68 182.25,19.68 E5.2 | E11.11 140.34,51.44 141.61,52.7 161.29,52.7 173.36,40.64 174.63,40.64 R4.1 175.9,40.64 179.71,40.64 184.79,35.56 R3.2 | E23.10 131.45,116.2 130.18,114.94 103.51,114.94 102.24,116.2 E22.12 100.97,117.47 99.7,118.75 98.43,118.75 97.16,117.47 E22.10 95.89,116.2 94.62,114.94 65.41,114.94 64.14,116.2 E21.10
ADD_ACC  (via drill 0.81)
  Top 0.508: v128.27,127.64 128.27,115.57 140.97,102.87 140.97,90.17 148.59,82.55 148.59,73.66 149.86,72.39 E15.1
  Bottom 0.508: v128.27,127.64 127.64,128.27 24.77,128.91 14.61,118.75 13.97,118.11 EDGE.BS2
B_BTS1  (via drill 0.81)
  Top 0.508: v15.88,114.94 13.97,115.57 EDGE.BR1
  Bottom 0.508: W1.1 27.31,114.94 v15.88,114.94
B_C0_L  (via drill 0.81)
  Top 0.508: v140.97,10.79 140.97,13.97 138.43,16.51 138.43,33.02 134.62,36.83 E10.8
  Bottom 0.508: v140.97,10.79 165.74,10.79 167.01,12.06 E5.9
B_C1  (via drill 0.81)
  Top 0.508: v139.7,53.98 139.7,54.61 142.24,57.15 E11.5 | v18.42,55.24 17.15,53.98 17.15,45.09 13.97,41.91 EDGE.AP1
  Bottom 0.508: v139.7,53.98 48.9,53.98 47.63,55.24 v18.42,55.24
B_INT_STROBE
  Top 0.508: E1.10 28.58,10.79 22.23,10.79 22.23,72.39 17.15,77.47 17.15,90.81 14.61,93.34 EDGE.BH1
B_TIME_1_L  (via drill 0.81)
  Top 0.508: v38.1,41.91 E7.2 | v15.88,40.64 14.61,39.37 13.97,39.37 EDGE.AN1
  Bottom 0.508: v38.1,41.91 36.83,40.64 v15.88,40.64
B_TIME_2_L  (via drill 0.81)
  Top 0.508: v18.42,48.9 18.42,45.09 17.15,43.81 17.15,31.75 14.61,29.21 EDGE.AK1
  Bottom 0.508: E7.4 29.85,48.9 v18.42,48.9
B_TIME_3_L  (via drill 0.81)
  Top 0.508: v26.67,34.92 26.67,43.18 27.94,44.45 E7.6 | v15.88,34.29 14.61,33.02 13.97,33.02 EDGE.AL1
  Bottom 0.508: v26.67,34.92 26.04,34.29 v15.88,34.29
B_TIME_4_L  (via drill 0.81)
  Top 0.508: v15.88,36.2 13.97,36.2 EDGE.AM1
  Bottom 0.508: E7.12 33.66,36.2 v15.88,36.2
BK_CYCLE  (via drill 0.81)
  Top 0.508: v97.79,50.8 97.79,96.52 99.06,97.79 E18.4
  Bottom 0.508: E18.5 97.16,98.42 98.43,98.42 E18.4 | 115.57,43.18 134.62,43.18 135.26,43.81 | 115.57,43.18 114.3,43.18 109.86,38.73 E9.12 | 135.26,43.81 136.53,45.09 E10.6 | 135.26,43.81 145.42,43.81 146.69,45.09 E10.2 | v97.79,50.8 100.97,47.62 114.94,47.62 115.57,46.99 115.57,43.18
BK_CYCLE_L
  Top 0.508: 143.51,59.69 143.51,48.26 142.24,46.99 E10.4 | 143.51,59.69 143.51,60.96 144.78,62.23 E15.12 | 143.51,59.69 140.97,62.23 140.97,88.9 139.7,90.17 E19.11
  Bottom 0.508: E10.4 142.88,45.09 144.15,45.09 E10.3
BRK  (via drill 0.81)
  Top 0.508: E11.2 149.23,57.78 147.96,57.78 E11.3 147.32,59.69 146.05,60.96 146.05,74.3 144.15,76.2 142.24,76.2 E15.4 | v72.39,84.45 80.01,76.83 v80.01,67.31
  Bottom 0.508: E16.6 26.04,100.97 18.42,100.97 17.15,99.69 17.15,89.53 31.12,89.53 36.2,84.45 v72.39,84.45 | v80.01,67.31 138.43,67.31 E15.4
BRK_0  (via drill 0.81)
  Top 0.508: v148.59,9.53 148.59,53.34 144.78,57.15 E11.4 | v55.25,13.34 49.53,19.05 v49.53,50.8
  Bottom 0.508: v148.59,9.53 59.06,9.53 v55.25,13.34 | v49.53,50.8 47.63,52.7 15.24,52.7 14.61,52.07 13.97,52.07 EDGE.AT2
BRK_1  (via drill 0.81)
  Top 0.508: v146.05,8.26 146.05,14.61 143.51,17.14 143.51,46.99 144.78,48.26 144.78,49.53 E11.13 | v29.21,9.53 20.96,9.53 v20.96,46.99
  Bottom 0.508: v146.05,8.26 48.26,8.26 46.99,9.53 v29.21,9.53 | v20.96,46.99 16.51,46.99 15.24,48.26 13.97,48.26 EDGE.AS2
BRK_L  (via drill 0.81)
  Top 0.508: v17.15,101.6 17.15,106.68 13.97,109.22 EDGE.BN1
  Bottom 0.508: E19.3 141.61,98.42 140.34,98.42 E19.4 135.89,102.87 37.47,102.87 35.56,100.97 28.58,100.97 | 28.58,100.97 27.31,102.23 17.78,102.23 v17.15,101.6 | 28.58,100.97 E16.5
BTP1
  Top 0.508: E1.2 38.1,19.05 34.29,15.24 34.29,11.43 31.12,8.26 16.51,8.26 14.61,10.16 13.97,10.16 EDGE.AC1
BTP2  (via drill 0.81)
  Top 0.508: v17.15,15.88 14.61,13.97 EDGE.AD1
  Bottom 0.508: E1.4 28.58,15.88 v17.15,15.88
BTP3  (via drill 0.81)
  Top 0.508: v15.88,17.14 13.97,17.14 EDGE.AE1
  Bottom 0.508: E1.6 24.77,17.14 v15.88,17.14
BTP4  (via drill 0.81)
  Top 0.508: v19.69,14.61 19.69,15.24 14.61,20.32 EDGE.AF1
  Bottom 0.508: E1.12 33.66,14.61 v19.69,14.61
BTS1  (via drill 0.81)
  Top 0.508: E4.10 139.07,12.06 137.8,12.06 E4.9 137.16,13.97 130.81,20.32 130.81,90.81 v127,94.61 | E18.1 106.68,97.79 104.14,95.25 104.14,92.71 E18.13 | W1.2 28.58,112.39 31.75,115.57 31.75,125.73 32.39,126.36 39.37,126.36 39.37,111.12 40.64,109.86 40.64,100.33 E16.1
  Bottom 0.508: 76.84,93.98 101.6,93.98 | 76.84,93.98 68.58,93.98 66.68,92.08 E17.11 | 101.6,93.98 103.51,92.08 E18.13 | 76.84,93.98 74.3,96.52 41.91,96.52 40.64,97.79 E16.1 | v127,94.61 126.37,93.98 101.6,93.98
BTS1_L  (via drill 0.81)
  Top 0.508: v38.1,109.22 38.1,100.33 E16.2 | v103.51,111.12 104.14,111.76 104.14,115.57 E22.13
  Bottom 0.508: v38.1,109.22 40.01,111.12 v103.51,111.12
BTS3  (via drill 0.81)
  Top 0.508: E7.8 25.4,43.18 26.67,44.45 26.67,57.15 31.75,62.23 v31.75,66.04 31.75,74.93 36.83,80.01 36.83,96.52 35.56,97.79 E16.3 | v18.42,99.06 18.42,118.11 13.97,118.11 EDGE.BS1
  Bottom 0.508: E13.11 64.14,65.41 44.45,65.41 43.82,66.04 v31.75,66.04 | v18.42,99.06 20.32,97.16 33.66,97.16 E16.3
BTS3_L  (via drill 0.81)
  Top 0.508: E19.5 137.16,97.79 138.43,96.52 138.43,73.66 139.7,72.39 E15.5 | E16.4 27.94,104.14 v27.94,104.78 | v15.88,104.78 14.61,105.41 EDGE.BM1 | v97.16,101.6 99.06,103.5 E22.11
  Bottom 0.508: v15.88,104.78 v27.94,104.78 29.21,104.78 38.1,113.67 95.89,113.67 E22.11 | E19.5 134.62,101.6 v97.16,101.6
C0_L  (via drill 0.81)
  Top 0.508: E10.13 146.69,37.47 145.42,37.47 E10.12 144.78,39.37 146.05,40.64 v146.05,53.98 | v15.88,56.52 15.24,55.88 14.61,55.24 13.97,54.61 EDGE.AU1
  Bottom 0.508: v146.05,53.98 144.78,55.24 108.59,55.24 106.05,57.78 52.71,57.78 51.44,59.05 33.66,59.05 32.39,57.78 19.69,57.78 18.42,56.52 v15.88,56.52
C1  (via drill 0.81)
  Top 0.508: v25.4,53.98 23.5,52.07 v23.5,47.62
  Bottom 0.508: v25.4,53.98 47.63,53.98 48.9,52.7 69.22,52.7 69.85,52.07 111.76,52.07 112.4,52.7 135.26,52.7 136.53,51.44 E11.10 | v23.5,47.62 20.32,44.45 16.51,44.45 15.24,43.18 13.97,41.91 EDGE.AP2
C1_L  (via drill 0.81)
  Top 0.508: v19.69,29.84 19.69,55.88 17.78,57.78 13.97,57.78 EDGE.AV1
  Bottom 0.508: v19.69,29.84 74.93,29.84 74.93,18.41 77.47,15.88 108.59,15.88 111.13,13.34 E3.13
CLR_AC  (via drill 0.81)
  Top 0.508: v31.75,59.05 31.75,36.83 46.36,22.23 46.36,9.53 48.26,7.62 48.26,5.71 146.69,5.71 151.13,10.16 151.13,15.24 170.18,15.24 174.63,19.68 E5.5
  Bottom 0.508: v31.75,59.05 19.69,59.05 19.05,58.42 13.97,58.42 EDGE.AV2
CLR_TIME_PSE_L  (via drill 0.81)
  Top 0.508: v90.81,40.64 89.54,41.91 89.54,88.27 91.44,90.17 E18.8 | v80.01,92.71 80.01,124.46 74.3,124.46 E21.1
  Bottom 0.508: v90.81,40.64 99.06,40.64 100.97,38.73 E9.9 | v80.01,92.71 80.65,92.08 90.81,92.08 E18.8
CLR_TP_L
  Top 0.508: 71.12,73.03 73.66,73.03 73.66,72.39 E13.1 | 71.12,73.03 70.49,73.03 69.85,72.39 69.85,66.04 71.12,64.77 E13.13 | E20.8 25.4,118.11 25.4,119.38 29.85,123.83 E20.5 | 72.39,114.3 73.66,113.03 73.66,100.33 E17.1 73.66,97.79 72.39,96.52 72.39,93.98 71.12,92.71 E17.13 71.12,90.17 71.12,73.03 | 72.39,114.3 71.12,115.57 E21.13 | 72.39,114.3 72.39,126.36 104.78,126.36 106.05,125.09 E22.1
  Bottom 0.508: E14.2 111.13,70.48 109.22,68.58 74.93,68.58 73.66,69.85 E13.1 | E20.5 31.12,123.83 34.29,120.65 67.31,120.65 70.49,117.47 E21.13
GND  (via drill 0.81)
  Top 1.27: C22.- 45.09,6.35 45.09,16.51 43.18,18.41 C1.2 43.18,22.86 26.67,22.86 26.35,22.54 | 26.35,22.54 25.4,21.59 E1.7 | 26.35,22.54 23.81,25.08 | 23.81,25.08 23.5,25.4 23.5,43.81 E7.7 25.4,50.8 v24.77,51.44 | v23.5,13.34 23.5,24.77 23.81,25.08 | v15.88,51.44 13.97,51.44 EDGE.AT1 | E8.7 58.42,44.45 56.52,42.55 56.52,23.5 58.42,21.59 E2.7 | C10.2 43.18,70.48 45.09,72.39 45.09,77.47 C23.- | 23.81,81.6 25.4,80.01 E12.7 | 23.81,81.6 23.5,81.92 23.5,95.89 25.4,97.79 E16.7 25.4,100.33 24.77,100.97 24.77,109.22 23.5,110.49 23.5,123.83 | 23.81,81.6 v23.5,81.28 | 23.5,123.83 17.15,123.83 15.24,121.92 13.97,121.92 EDGE.BT1 | 23.5,123.83 24.77,123.83 E20.7 | E17.7 58.42,100.33 56.52,102.23 56.52,121.28 58.42,123.19 E21.7 | C27.2 165.1,24.77 167.64,22.23 E5.8 | E4.2 E4.13 | E4.5 140.34,19.68 141.61,19.68 E4.4 142.24,16.51 144.78,13.97 E4.12 | E19.1 146.69,98.42 145.42,98.42 E19.2 E19.13 144.78,90.17 152.4,82.55 C13.2 | C20.2 109.22,122.56 111.13,120.65 111.13,100.33 109.22,98.42 C16.2 | C7.2 76.2,45.09 78.11,46.99 v78.11,48.26 78.11,67.31 76.2,69.22 C11.2 | E10.7 E11.9 E11.8 134.62,59.69 137.16,62.23 E15.9 136.53,64.14 136.53,67.94 134.62,69.85 E15.7 | R3.1 175.26,36.2 172.09,39.37 172.09,56.52 168.28,60.33 168.28,63.5 170.18,65.41 C26.2 | C19.2 76.2,122.56 78.11,120.65 78.11,100.33 76.2,98.42 C15.2
  Bottom 1.27: C6.2 43.82,44.45 44.45,45.09 57.79,45.09 E8.7 58.42,46.99 59.69,48.26 v78.11,48.26 96.52,48.26 E9.7 | C1.2 57.15,19.05 E2.7 | v23.5,13.34 20.32,10.16 12.7,10.16 EDGE.AC2 | v24.77,51.44 v15.88,51.44 | E13.7 57.15,69.85 C10.2 42.55,69.85 41.28,68.58 29.85,68.58 29.53,68.9 | 29.53,68.9 30.48,69.85 E12.5 31.12,70.48 32.39,70.48 E12.4 | 29.53,68.9 29.21,68.58 26.67,68.58 25.4,69.85 E12.7 | v23.5,81.28 15.88,81.28 14.61,80.01 13.97,80.01 EDGE.BC2 | E22.7 90.81,123.83 77.47,123.83 76.84,123.19 C19.2 76.2,127 59.69,127 58.42,125.73 E21.7 57.79,123.83 44.45,123.83 | C14.2 43.82,97.79 44.45,98.42 57.79,98.42 E17.7 | 44.45,123.83 43.82,123.19 C18.2 | 44.45,123.83 41.28,127 26.67,127 25.4,125.73 E20.7 | 87,19.68 98.43,19.68 E3.7 99.06,19.05 100.97,17.14 114.3,17.14 116.21,19.05 C3.2 117.48,19.05 118.11,19.68 133.99,19.68 E4.7 134.62,19.05 135.89,17.78 138.43,17.78 139.7,19.05 E4.5 | 87,19.68 77.47,19.68 76.84,19.05 C2.2 | 87,19.68 99.06,31.75 E6.7 | R3.1 167.01,35.56 | 167.01,35.56 161.93,35.56 153.04,44.45 C9.2 | C5.2 187.33,19.05 186.06,17.78 168.91,17.78 167.64,19.05 E5.8 166.37,19.05 C4.2 151.77,19.05 151.13,19.68 150.5,19.68 E4.1 149.23,19.68 147.96,19.68 E4.2 | E4.12 145.42,12.06 146.69,12.06 E4.13 | 167.01,35.56 167.01,26.04 165.1,26.04 C27.2 | C20.2 109.86,123.19 110.49,123.83 128.91,123.83 E23.8 129.54,123.19 130.81,121.92 147.96,121.92 149.23,123.19 C21.2 | C15.2 76.84,97.79 77.47,98.42 90.81,98.42 E18.7 91.44,97.79 92.71,96.52 107.32,96.52 108.59,97.79 C16.2 109.86,97.79 110.49,98.42 131.45,98.42 E19.7 132.08,97.79 133.35,96.52 143.51,96.52 144.78,97.79 E19.2
  Bottom 1.27: C17.2 149.23,97.79 148.59,98.42 147.96,98.42 E19.1 | C11.2 97.79,69.85 E14.7 99.06,72.39 100.33,73.66 114.94,73.66 118.11,70.48 | C26.2 156.85,66.04 153.04,69.85 C13.2 151.77,69.85 147.96,66.04 141.61,66.04 139.7,64.14 E15.10 139.07,62.87 137.8,62.87 E15.9 | 118.11,70.48 117.48,69.85 C12.2 | 118.11,70.48 133.99,70.48 E15.7 | C8.2 117.48,44.45 118.11,45.09 133.99,45.09 E10.7
INIT  (via drill 0.81)
  Top 0.508: R13.1 175.26,61.59 175.26,73.03 R12.1 | v30.48,32.38 30.48,36.83 E7.10 | v84.46,31.11 94.62,41.27 v94.62,74.93 94.62,89.53 95.25,90.17 95.25,95.25 97.79,97.79 97.79,100.33 98.43,100.97 101.6,100.97 101.6,100.33 E18.3
  Bottom 0.508: v30.48,32.38 31.75,31.11 v84.46,31.11 | E18.2 103.51,98.42 102.24,98.42 E18.3 | v94.62,74.93 115.57,74.93 116.84,73.66 174.63,73.66 R12.1
INITIALIZE  (via drill 0.81)
  Top 0.508: v44.45,81.92 41.91,79.38 41.91,56.52 v35.56,50.16 | v15.88,49.53 14.61,48.26 EDGE.AS1
  Bottom 0.508: v44.45,81.92 64.14,81.92 66.04,80.01 139.7,80.01 142.24,77.47 176.53,77.47 176.53,67.94 177.17,67.31 178.44,67.31 179.71,68.58 Q1.1 | v35.56,50.16 16.51,50.16 v15.88,49.53
INITIALIZE_L  (via drill 0.81)
  Top 0.508: 36.83,103.5 36.83,114.3 35.56,115.57 E20.12 | 36.83,103.5 36.83,97.79 39.37,95.25 39.37,69.85 34.29,64.77 34.29,40.64 33.02,39.37 E7.11 v38.74,32.38 | v15.88,102.87 15.88,99.06 13.97,99.06 EDGE.BK1 | 36.83,103.5 v36.2,103.5
  Bottom 0.508: E9.2 106.05,40.01 103.51,40.01 102.87,39.37 102.87,34.92 81.28,34.92 78.74,32.38 v38.74,32.38 | v15.88,102.87 16.51,103.5 v36.2,103.5
IO_END
  Top 0.508: E22.5 96.52,123.19 95.25,121.92 95.25,96.52 93.98,95.25 93.98,92.71 E18.9
  Bottom 0.508: E18.9 94.62,90.81 95.89,90.81 E18.10
IO_END_CLK
  Top 0.508: E3.8 99.06,13.97 100.33,15.24 100.33,47.62 102.87,50.16 102.87,109.86 100.33,112.39 100.33,121.92 101.6,123.19 E22.3
IO_END_CLK_L  (via drill 0.81)
  Top 0.508: E16.9 27.94,90.17 26.67,88.9 26.67,66.04 25.4,64.77 E12.8 25.4,62.23 v25.4,56.52 | v106.68,55.24 110.49,51.44 110.49,24.13 113.67,20.95 E3.1
  Bottom 0.508: E3.1 113.67,19.68 112.4,18.41 103.51,18.41 102.87,19.05 102.87,23.5 182.25,23.5 184.79,20.95 E5.1 | v25.4,56.52 50.8,56.52 52.07,55.24 v106.68,55.24
IO_PSE  (via drill 0.81)
  Top 0.508: v22.86,106.05 19.69,102.87 19.69,98.42 17.78,96.52 13.34,96.52 EDGE.BJ1 | v102.87,113.67 102.87,121.92 104.14,123.19 E22.2 | v62.87,112.39 60.96,114.3 E21.9
  Bottom 0.508: E21.9 59.06,114.94 36.2,114.94 27.31,106.05 v22.86,106.05 | v102.87,113.67 101.6,112.39 v62.87,112.39
IOP1  (via drill 0.81)
  Top 0.508: E12.13 38.1,64.77 40.64,67.31 40.64,69.85 E12.1 | v15.88,78.74 15.88,79.38 15.88,81.92 14.61,83.19 13.97,83.82 EDGE.BD1
  Bottom 0.508: v15.88,78.74 19.69,74.93 36.83,74.93 40.01,71.75 E12.1
IOP2  (via drill 0.81)
  Top 0.508: E12.3 36.2,70.48 37.47,70.48 E12.2 v38.1,80.64 | EDGE.BE1 13.97,86.36 v15.88,86.36
  Bottom 0.508: v38.1,80.64 35.56,83.19 19.05,83.19 v15.88,86.36
IOP4  (via drill 0.81)
  Top 0.508: E12.10 29.85,62.87 28.58,62.87 E12.9 27.94,64.77 29.21,66.04 v29.21,84.45 | v15.88,90.17 13.97,90.17 EDGE.BF1
  Bottom 0.508: v29.21,84.45 25.4,88.27 15.88,88.27 v15.88,90.17
MEM_START  (via drill 0.81)
  Top 0.508: v15.88,113.03 14.61,111.76 EDGE.BP1
  Bottom 0.508: v15.88,113.03 24.13,113.03 W1.3
N$1  (via drill 0.81)
  Top 0.508: v153.67,38.1 153.67,55.88 152.4,57.15 E11.1
  Bottom 0.508: E6.8 99.7,26.04 102.87,29.21 140.34,29.21 141.61,30.48 R18.1 142.88,30.48 146.05,30.48 v153.67,38.1
N$2  (via drill 0.81)
  Top 0.508: v112.4,6.99 121.92,16.51 121.92,27.3 119.38,29.84 R17.2
  Bottom 0.508: v112.4,6.99 48.26,6.99 47.63,7.62 29.21,7.62 25.4,11.43 E1.8 | E6.1 116.84,30.48 R17.2
N$4  (via drill 0.81)
  Top 0.508: v165.1,46.99 170.18,46.99 170.18,46.35 C30.1
  Bottom 0.508: C30.1 170.82,45.72 174.63,45.72 R16.1 | v165.1,46.99 153.67,46.99 150.5,50.16 E11.15
N$5
  Bottom 0.508: E11.14 147.96,50.16 152.4,45.72 164.47,45.72 169.55,40.64 C30.2
N$6  (via drill 0.81)
  Top 0.508: v95.89,88.27 95.89,42.55 99.06,39.37 E9.8 | v69.85,88.27 69.85,96.52 68.58,97.79 E17.3
  Bottom 0.508: v95.89,88.27 v69.85,88.27
N$7  (via drill 0.81)
  Top 0.508: v104.14,66.04 104.14,69.85 E14.5 104.78,70.48 106.05,70.48 E14.4
  Bottom 0.508: v104.14,66.04 101.6,66.04 99.7,64.14 E14.8
N$8  (via drill 0.81)
  Top 0.508: v101.6,82.55 101.6,72.39 E14.6 | DL1.1 185.42,91.44 185.42,81.92 R11.1
  Bottom 0.508: v101.6,82.55 183.52,82.55 184.79,81.28 R11.1
N$9  (via drill 0.81)
  Top 0.508: DL1.3 175.26,91.44 175.26,100.97 R10.1 | v51.44,109.86 51.44,112.39 40.64,123.19 E20.1
  Bottom 0.508: E20.2 38.74,123.83 40.01,123.83 E20.1 | v51.44,109.86 55.88,105.41 175.9,105.41 176.53,104.78 176.53,102.23 175.26,102.23 R10.1
N$10
  Top 0.508: DL2.1 185.42,111.76 185.42,118.75 R9.1 185.42,120.02 186.69,121.28 186.69,128.91 32.39,128.91 28.58,125.09 E20.6
N$11  (via drill 0.81)
  Top 0.508: R8.1 175.26,111.76 DL2.3 | E20.13 38.1,111.12 39.37,109.86 v39.37,107.95
  Bottom 0.508: v39.37,107.95 43.18,104.14 R8.1
N$12
  Top 0.508: E20.9 28.58,116.2 29.85,116.2 E20.10
  Bottom 0.508: E20.11 32.39,116.2 31.12,116.2 E20.10
N$13
  Bottom 0.508: E23.14 142.88,116.2 144.15,114.94 162.56,114.94 164.47,116.84 C28.2
N$14
  Top 0.508: E23.15 145.42,117.47 147.32,119.38 153.04,119.38 153.04,111.76 154.94,109.86 R6.1
  Bottom 0.508: C28.1 164.47,111.76 161.93,109.22 155.58,109.22 R6.1
N$15
  Bottom 0.508: E23.9 130.18,117.47 131.45,118.75 137.8,118.75 139.07,117.47 E23.13
N$16
  Top 0.508: E23.7 132.72,125.09 135.26,127.64 185.42,127.64 185.42,122.56 R7.1
N$17
  Bottom 0.508: Q1.2 178.44,68.58 183.52,73.66 184.79,73.66 R12.2
N$18
  Top 0.508: R14.1 175.26,56.52 177.8,59.05 177.8,65.41 Q1.3
N$20  (via drill 0.81)
  Top 0.508: v120.65,24.77 115.57,19.68 115.57,19.05 109.86,13.34 E3.12 | E10.11 142.24,36.83 140.97,35.56 140.97,29.84 142.24,28.57 R5.1
  Bottom 0.508: v120.65,24.77 122.56,26.67 140.34,26.67 141.61,27.94 R5.1
N$21
  Top 0.508: R5.2 132.08,28.57 133.35,29.84 133.35,39.37 133.99,40.01 137.16,40.01 137.16,39.37 E10.9 137.8,37.47 139.07,37.47 E10.10
  Bottom 0.508: C27.1 164.47,30.48 154.31,40.64 142.24,40.64 140.34,38.73 E10.10
N$22
  Top 0.508: C25.2 180.34,8.26 180.34,11.43 E5.14
N$23
  Top 0.508: C25.1 185.42,8.26 182.88,10.79 182.88,11.43 E5.15 182.88,13.97 181.61,15.24 181.61,23.5 175.26,29.84 R2.1
N$24
  Bottom 0.508: E3.5 104.78,20.95 106.05,22.23 175.9,22.23 177.17,20.95 E5.4
N$25  (via drill 0.81)
  Top 0.508: v42.55,85.72 50.8,77.47 v50.8,57.78 | v104.14,56.52 105.41,55.24 105.41,22.86 106.68,21.59 E3.4
  Bottom 0.508: v42.55,85.72 36.2,85.72 31.12,90.81 E16.10 | v50.8,57.78 52.07,56.52 v104.14,56.52
N$26  (via drill 0.81)
  Top 0.508: E3.2 111.76,19.05 106.68,13.97 E3.11 106.68,11.43 106.68,9.53 99.7,9.53 83.19,26.04 83.19,100.33 v82.55,100.97
  Bottom 0.508: v82.55,100.97 39.37,100.97 39.37,97.79 37.47,95.89 33.02,95.89 33.02,92.71 E16.11
N$27
  Top 0.508: E3.10 104.14,13.97 101.6,16.51 101.6,19.05 E3.6
N$28
  Top 0.508: E3.9 102.24,12.06 103.51,10.79 105.41,10.79 105.41,15.24 109.22,19.05 E3.3
N$29  (via drill 0.81)
  Top 0.508: v26.67,118.75 26.67,93.98 25.4,92.71 E16.8
  Bottom 0.508: v26.67,118.75 27.31,119.38 63.5,119.38 65.41,117.47 E21.11
N$30  (via drill 0.81)
  Top 0.508: v138.43,65.41 138.43,48.26 139.7,46.99 E10.5
  Bottom 0.508: v138.43,65.41 142.24,69.22 142.88,69.22 144.15,70.48 E15.3
N$31
  Bottom 0.508: E9.11 107.32,38.73 113.67,45.09 E9.1
N$32
  Top 0.508: E9.3 108.59,45.09 107.32,45.09 E9.4
  Bottom 0.508: E9.5 104.78,45.09 106.05,45.09 E9.4
N$33
  Bottom 0.508: E11.6 140.34,57.78 141.61,56.52 170.18,56.52 C29.2
N$34
  Bottom 0.508: 171.45,50.8 174.63,50.8 R15.1 | 171.45,50.8 170.82,50.8 C29.1 | 171.45,50.8 171.45,56.52 167.64,60.33 139.07,60.33 137.8,59.05 E11.7
N$35  (via drill 0.81)
  Top 0.508: v132.08,35.56 132.08,71.12 133.99,73.03 137.16,73.03 137.16,72.39 E15.6
  Bottom 0.508: v132.08,35.56 106.68,35.56 104.78,37.47 E9.10
N$36  (via drill 0.81)
  Top 0.508: v84.46,73.03 88.27,69.22 v88.27,62.23 | v114.3,59.05 128.27,45.09 128.27,20.32 134.62,13.97 E4.8
  Bottom 0.508: v84.46,73.03 70.49,73.03 69.22,71.75 E13.3 | v88.27,62.23 91.44,59.05 v114.3,59.05
N$37
  Top 0.508: E2.4 66.04,19.05 67.31,17.78 67.31,10.79 69.22,10.79 70.49,12.06 E2.13 71.12,13.97 69.85,15.24 69.85,28.57 71.12,29.84 71.12,36.83 E8.13 71.12,39.37 73.66,41.91 73.66,44.45 E8.1
  Bottom 0.508: E9.6 100.97,45.09 99.7,43.81 78.74,43.81 76.84,45.72 74.3,45.72 E8.1
N$38
  Top 0.508: E21.3 69.22,125.09 71.76,127.64 127,127.64 127,107.95 134.62,100.33 E19.6
N$39
  Top 0.508: E5.6 172.72,21.59 170.18,24.13 170.18,24.77 C24.2
N$40
  Top 0.508: 170.18,29.84 168.91,28.57 168.91,22.86 170.18,21.59 E5.7 | 170.18,29.84 C24.1 170.18,29.84 | 170.18,29.84 174.63,25.4 R1.1
N$41  (via drill 0.81)
  Top 0.508: v29.21,34.92 29.21,35.56 27.94,36.83 E7.9 | v78.11,33.66 81.28,36.83 81.28,102.87 93.98,115.57 E22.9
  Bottom 0.508: v29.21,34.92 30.48,33.66 v78.11,33.66
N$42  (via drill 0.81)
  Top 0.508: v63.5,80.64 63.5,90.17 E17.10 | v143.51,74.93 143.51,66.04 142.24,64.77 E15.11
  Bottom 0.508: v63.5,80.64 66.68,77.47 140.97,77.47 v143.51,74.93
N$43
  Bottom 0.508: W2.1 19.05,111.76 13.97,111.76 EDGE.BP2
N$44  (via drill 0.81)
  Top 0.508: 64.77,27.94 64.77,35.56 66.04,36.83 E8.11 66.04,39.37 67.31,40.64 67.31,43.18 | 64.77,27.94 64.77,15.24 66.04,13.97 E2.11 | E2.3 68.58,24.13 64.77,27.94 | 67.31,43.18 68.58,44.45 E8.3 | v132.08,88.27 E19.8 | v68.58,87 67.31,85.72 67.31,43.18
  Bottom 0.508: v132.08,88.27 130.81,87 v68.58,87
N$45
  Bottom 0.508: W2.2 17.78,109.22 15.24,106.68 13.97,105.41 EDGE.BM2
RECYCLE
  Top 0.508: E23.5 137.8,123.83 143.51,118.11 143.51,88.9 151.13,81.28 151.13,68.58 147.32,64.77 E15.13
SHIFT_TS  (via drill 0.81)
  Top 0.508: v35.56,94.61 34.29,95.89 34.29,121.92 33.02,123.19 E20.4 33.66,123.83 34.93,123.83 E20.3 | E9.13 111.76,39.37 113.03,40.64 113.03,67.31 115.57,69.85 115.57,85.09 126.37,95.89 134.62,95.89 134.62,92.71 E19.9 135.26,90.81 136.53,90.81 E19.10
  Bottom 0.508: v35.56,94.61 36.2,94.61 38.1,92.71 E16.13 38.74,90.81 40.01,89.53 132.72,89.53 133.99,90.81 E19.9
SHIFT_TS_L  (via drill 0.81)
  Top 0.508: v31.75,76.83 31.75,86.36 35.56,90.17 E16.12 | v111.76,76.2 114.3,73.66 114.3,72.39 E14.1
  Bottom 0.508: v31.75,76.83 32.39,76.2 47.63,76.2 48.9,74.93 92.71,74.93 93.98,76.2 v111.76,76.2
TIME_PAUSE
  Bottom 0.508: E21.5 64.14,123.83 66.04,121.92 106.68,121.92 107.95,123.19 107.95,126.36 145.42,126.36 146.69,125.09 E23.1
TP1  (via drill 0.81)
  Top 0.508: v66.04,24.77 67.31,23.5 67.31,19.05 68.58,17.78 68.58,13.97 E2.12 | v55.25,21.59 55.25,62.87 62.87,70.48 E13.5
  Bottom 0.508: v66.04,24.77 60.33,24.77 57.15,21.59 v55.25,21.59 41.91,21.59 41.28,20.95 E1.1
TP1_L  (via drill 0.81)
  Top 0.508: v68.58,68.58 v68.58,66.04 | v99.06,66.04 100.97,64.14 E14.9 101.6,62.23 v101.6,50.8
  Bottom 0.508: v68.58,68.58 63.5,68.58 61.6,70.48 E13.6 | v68.58,66.04 v99.06,66.04 | v101.6,50.8 103.51,48.9 146.69,48.9 149.23,46.35 E10.1
TP2  (via drill 0.81)
  Top 0.508: v66.04,28.57 69.85,32.38 69.85,43.18 71.12,44.45 E8.2 | v62.23,42.55 62.23,60.96 60.96,62.23 E13.9
  Bottom 0.508: v66.04,28.57 43.82,28.57 36.2,20.95 E1.3 | v62.23,42.55 63.5,43.81 69.22,43.81 70.49,45.09 E8.2
TP2_L
  Bottom 0.508: E13.8 59.06,62.87 60.33,61.59 85.73,61.59 87.63,63.5 96.52,63.5 98.43,61.59 102.24,61.59 103.51,62.87 E14.10
TP3  (via drill 0.81)
  Top 0.508: E1.11 33.02,13.97 32.39,14.61 32.39,17.14 30.48,19.05 E1.5 | v31.75,24.77 v31.75,34.92 | v147.32,78.74 147.32,72.39 E15.2 | v93.35,81.28 90.81,78.74 v90.81,42.55 | v53.98,34.92 53.98,89.53 59.69,95.25 59.69,100.97 61.6,100.97 62.87,99.69 E17.5
  Bottom 0.508: 66.68,36.2 65.41,34.92 v53.98,34.92 v31.75,34.92 | 66.68,36.2 67.95,37.47 E8.12 | v31.75,24.77 31.75,21.59 30.48,21.59 E1.5 | v147.32,78.74 144.78,81.28 v93.35,81.28 | v90.81,42.55 84.46,36.2 66.68,36.2
TP3_L  (via drill 0.81)
  Top 0.508: v62.23,88.27 62.23,96.52 60.96,97.79 E17.6 | v104.14,85.72 107.95,81.92 107.95,66.04 109.22,64.77 E14.12
  Bottom 0.508: v62.23,88.27 64.77,85.72 v104.14,85.72
TP4  (via drill 0.81)
  Top 0.508: v59.69,17.78 59.69,64.77 64.77,69.85 64.77,72.39 60.96,76.2 60.96,90.17 E17.9
  Bottom 0.508: E1.13 38.74,13.34 43.18,17.78 v59.69,17.78 68.58,17.78 70.49,19.68 E2.2
TP4_L  (via drill 0.81)
  Top 0.508: v59.69,83.19 59.69,88.9 58.42,90.17 E17.8 | v107.95,83.82 110.49,81.28 110.49,66.04 111.76,64.77 E14.13
  Bottom 0.508: v59.69,83.19 100.33,83.19 100.97,83.82 v107.95,83.82
TS1  (via drill 0.81)
  Top 0.508: v72.39,22.23 74.93,24.77 74.93,66.04 71.12,69.85 E13.2 | v45.09,66.67 45.09,64.77 43.82,63.5 43.82,50.16 40.64,46.99 E7.1
  Bottom 0.508: v72.39,22.23 65.41,22.23 64.14,20.95 E2.5 | v45.09,66.67 45.72,67.31 69.22,67.31 71.12,69.22 71.12,69.85 E13.2
TS1_L  (via drill 0.81)
  Top 0.508: v54.61,10.79 57.15,13.34 57.15,13.97 59.69,16.51 60.96,16.51 60.96,19.05 E2.6
  Bottom 0.508: v54.61,10.79 29.85,10.79 28.58,12.06 E1.9
TS2  (via drill 0.81)
  Top 0.508: E2.9 60.33,12.06 57.79,9.53 47.63,9.53 47.63,26.04 36.83,36.83 36.83,43.18 35.56,44.45 E7.3 | v68.58,51.44 68.58,62.23 E13.12
  Bottom 0.508: v68.58,51.44 66.68,49.53 39.37,49.53 36.2,46.35 E7.3
TS3  (via drill 0.81)
  Top 0.508: 69.85,119.38 71.12,120.65 71.12,123.19 E21.2 | 69.85,119.38 68.58,118.11 E21.12 68.58,115.57 68.58,102.87 71.12,100.33 E17.2 | 69.85,119.38 67.31,121.92 67.31,125.73 66.68,126.36 52.71,126.36 v52.71,43.18 | v18.42,41.91 18.42,26.67 13.97,26.67 EDGE.AJ1
  Bottom 0.508: 33.02,43.18 31.12,45.09 E7.5 | 33.02,43.18 v52.71,43.18 60.96,43.18 62.87,45.09 E8.5 | v18.42,41.91 19.69,43.18 33.02,43.18
TS4  (via drill 0.81)
  Top 0.508: v66.04,76.2 66.04,87.63 68.58,90.17 E17.12 | v49.53,76.2 48.26,74.93 48.26,42.55 41.91,36.2 38.74,36.2 38.74,37.47 E7.13
  Bottom 0.508: E7.13 38.74,37.47 40.01,36.2 59.06,36.2 60.33,37.47 E8.9 | v49.53,76.2 v66.04,76.2
VCC  (via drill 0.81)
  Top 1.27: C14.1 43.18,93.34 45.09,95.25 45.09,111.12 40.64,115.57 E20.14 | v73.66,95.25 E17.14 | v22.86,73.66 C23.+ | v40.64,80.64 E16.14 | E1.14 40.64,11.43 34.93,5.71 24.13,5.71 C22.+ | 77.79,16.19 78.11,16.51 78.11,31.11 76.2,33.02 C7.1 76.2,40.01 80.01,43.81 v80.01,62.87 | 77.79,16.19 76.2,14.61 C2.1 | C10.1 43.18,67.31 44.45,68.58 46.99,68.58 46.99,43.81 43.18,40.01 C6.1 | R2.2 R1.2 185.42,24.77 187.01,23.18 | 187.01,23.18 189.87,20.32 189.87,16.51 187.96,14.61 C5.1 | 187.01,23.18 187.33,23.5 187.33,38.1 185.42,40.01 R4.2 R16.2 R15.2 R14.2 R13.2 185.42,61.59 182.25,64.77 182.25,73.66 175.26,80.64 R11.2 175.26,81.92 180.34,87 DL1.2 180.34,92.08 185.42,97.16 R10.2 R8.2 185.42,106.05 180.34,111.12 DL2.2 180.34,113.67 175.26,118.75 R9.2 R7.2 | C8.1 116.84,29.21 114.3,26.67 E6.14 | R17.1 129.54,46.99 114.3,62.23 E14.14 | E10.14 149.86,36.2 154.31,36.2 155.58,37.47 155.58,50.8 v154.94,51.44 154.94,61.59 152.4,64.14 C13.1 152.4,65.41 154.31,67.31 154.31,83.19 147.32,90.17 E19.14 | E23.16 147.32,112.39 144.78,109.86 R6.2 144.78,108.58 151.77,101.6 151.77,95.25 149.86,93.34 C17.1 | 77.79,16.19 78.11,15.88 91.44,15.88 99.06,8.26 111.13,8.26 114.3,11.43 E3.14
  Bottom 1.27: E17.14 74.93,92.71 C15.1 | E16.14 41.91,92.71 C14.1 43.82,92.71 46.36,95.25 v73.66,95.25 | E20.14 41.91,118.11 C18.1 | C10.1 41.91,64.77 E12.14 40.64,62.23 39.37,60.96 24.77,60.96 17.15,68.58 17.15,73.66 | 17.15,73.66 13.97,73.66 EDGE.BA2 | 17.15,73.66 v22.86,73.66 | v40.64,80.64 38.74,78.74 C23.+ | E1.14 41.91,13.97 C1.1 43.82,13.97 45.09,15.24 72.39,15.24 73.66,13.97 E2.14 74.93,13.97 C2.1 | EDGE.AA2 13.97,4.45 21.59,4.45 C22.+ | E13.14 74.93,64.77 C11.1 76.84,64.77 78.74,62.87 v80.01,62.87 | E7.14 41.91,39.37 C6.1 43.82,39.37 45.09,40.64 72.39,40.64 73.66,39.37 E8.14 74.93,39.37 C7.1 | E3.14 115.57,13.97 C3.1 117.48,13.97 118.75,15.24 148.59,15.24 149.86,13.97 E4.14 151.13,13.97 C4.1 153.04,13.97 154.31,15.24 184.15,15.24 185.42,13.97 E5.16 186.69,13.97 C5.1 | v154.94,51.44 153.04,51.44 E11.16 | E15.14 151.13,64.77 C13.1 | E9.14 115.57,39.37 C8.1 117.48,39.37 119.38,37.47 132.72,37.47 136.21,33.97 | E14.14 115.57,64.77 C12.1 | R17.1 R18.2 132.72,30.48 136.21,33.97 | C9.1 151.13,39.37 E10.14 149.86,36.83 148.59,35.56 137.8,35.56 136.21,33.97 | E18.14 107.95,92.71 C16.1 130.18,92.71 131.45,93.98 146.05,93.98 147.32,92.71 E19.14 148.59,92.71 C17.1 | E21.14 74.93,118.11 C19.1 76.84,118.11 78.74,120.02 104.78,120.02 106.68,118.11 E22.14 107.95,118.11 C20.1 109.86,118.11 111.76,120.02 145.42,120.02 147.32,118.11 E23.16 147.96,117.47 148.59,117.47 149.23,118.11 C21.1 150.5,118.11 151.77,119.38 R9.2

### Text on the board
Bottom: M7101 DW8E Control | VRS